# Altium schematic sheet 4-bit logic shifter.SchDoc
size A4
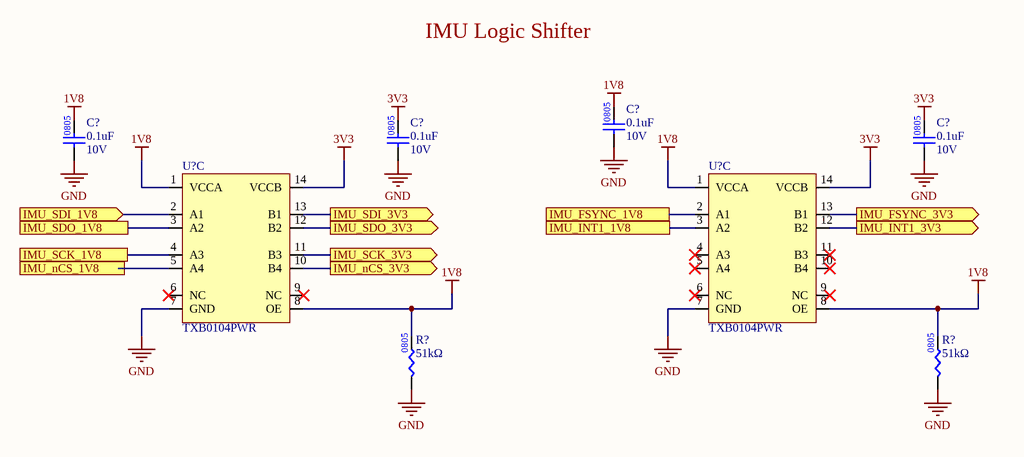
[diagram p0: 4-bit logic shifter.SchDoc]

## Parts
(Parts that share a designator on the sheet are numbered #1, #2 ... from top to bottom, then left to right.)
C?#1  value 0.1uF  Voltage Rating: 10V  [CAP0805]  (hidden comment: CAP_0.1uF_10V_0805)
C?#2  value 0.1uF  Voltage Rating: 10V  [CAP0805]  (hidden comment: CAP_0.1uF_10V_0805)
C?#3  value 0.1uF  Voltage Rating: 10V  [CAP0805]  (hidden comment: CAP_0.1uF_10V_0805)
C?#4  value 0.1uF  Voltage Rating: 10V  [CAP0805]  (hidden comment: CAP_0.1uF_10V_0805)
R?#1  value 51kΩ  [RES0805]  (hidden comment: RES_51kΩ_0805_5%)
R?#2  value 51kΩ  [RES0805]  (hidden comment: RES_51kΩ_0805_5%)
U?#1  TXB0104PWR  [TXB0104PWR 4-bit bidirectional voltage-level translator]  (part C of 3)
U?#2  TXB0104PWR  [TXB0104PWR 4-bit bidirectional voltage-level translator]  (part C of 3)

## Ports
IMU_FSYNC_1V8, IMU_FSYNC_3V3 (out), IMU_INT1_1V8, IMU_INT1_3V3 (out), IMU_nCS_1V8 (in), IMU_nCS_3V3 (out), IMU_SCK_1V8 (in), IMU_SCK_3V3 (out), IMU_SDI_1V8 (in), IMU_SDI_3V3 (out), IMU_SDO_1V8 (in), IMU_SDO_3V3 (out)

## Nets
1V8: C?#1.2 C?#2.2 R?#1.2 R?#2.2 U?#1.1(VCCA) U?#1.8(OE) U?#2.1(VCCA) U?#2.8(OE)
3V3: C?#3.2 C?#4.2 U?#1.14(VCCB) U?#2.14(VCCB)
GND: C?#1.1 C?#2.1 C?#3.1 C?#4.1 R?#1.1 R?#2.1 U?#1.7(GND) U?#2.7(GND)
IMU_FSYNC_1V8: U?#2.2(A1) ; port IMU_FSYNC_1V8
IMU_FSYNC_3V3: U?#2.13(B1) ; port IMU_FSYNC_3V3
IMU_INT1_1V8: U?#2.3(A2) ; port IMU_INT1_1V8
IMU_INT1_3V3: U?#2.12(B2) ; port IMU_INT1_3V3
IMU_nCS_1V8: U?#1.5(A4) ; port IMU_nCS_1V8
IMU_nCS_3V3: U?#1.10(B4) ; port IMU_nCS_3V3
IMU_SCK_3V3: U?#1.11(B3) ; port IMU_SCK_3V3
IMU_SDI_1V8: U?#1.2(A1) ; port IMU_SDI_1V8
IMU_SDI_3V3: U?#1.13(B1) ; port IMU_SDI_3V3
IMU_SDO_1V8: U?#1.3(A2) ; port IMU_SDO_1V8
IMU_SDO_3V3: U?#1.12(B2) ; port IMU_SDO_3V3

Not connected (* = marked no-connect by the designer): U?#1 4(A3) 6(NC)* 9(NC)*; U?#2 4(A3)* 5(A4)* 6(NC)* 9(NC)* 10(B4)* 11(B3)*

## Notes on the sheet
- IMU Logic Shifter
- (in symbol RES_51kΩ_0805_5%) 0805

## Library data of the parts
C?#1-C?#4 = CAP_0.1uF_10V_0805: CAP CER 0.1uF 10V 0805; Manufacturer 1: KEMET; Manufacturer Part Number 1: C0805C104K8RAC7800; Package/Footprint: 0805; Supplier 1: Digi-Key; Supplier Part Number 1: 399-C0805C104K8RAC7800DKR-ND
R?#1 R?#2 = RES_51kΩ_0805_5%: RES 51K OHM 1% 1/8W 0805; Manufacturer 1: Vishay Dale; Manufacturer Part Number 1: CRCW080551K0FKEA; Supplier 1: Digi-Key; Supplier Part Number 1: 541-51.0KCCT-ND
U?#1 U?#2 = IC_Bidirectional_Level_Shifter: Voltage Level Translator Bidirectional 1 Circuit 4 Channel 100Mbps 14-TSSOP; Manufacturer: Texas Instruments; Manufacture product number: TXB0104PWR; Supplier: Digikey; Mounting type: Surface Mount; Package: 14-TSSOP; ComponentLink1Description: Datasheet; ComponentLink1URL: https://www.digikey.ca/en/products/detail/texas-instruments/TXB0104PWR/1629102